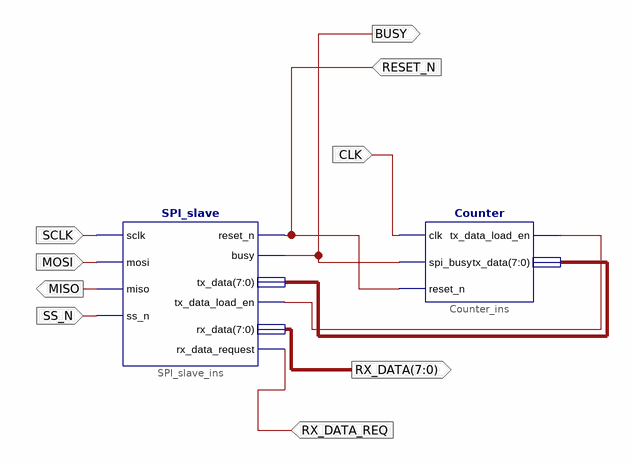
[diagram p0: schematic sheet 1]
// Xilinx ISE schematic Dummy_SPI.sch (spartan6) as structural Verilog: 2 symbols, 9 ports
module Dummy_SPI (
  input  RESET_N,
  input  SCLK,
  input  MOSI,
  input  SS_N,
  input  CLK,
  input  RX_DATA_REQ,
  output MISO,
  output BUSY,
  output [7:0] RX_DATA
);

  wire XLXN_1;
  wire [7:0] XLXN_2;

  SPI_slave SPI_slave_ins (
    .sclk(SCLK), .mosi(MOSI), .ss_n(SS_N), .rx_data_request(RX_DATA_REQ), .tx_data_load_en(XLXN_1),
    .reset_n(RESET_N), .tx_data(XLXN_2), .miso(MISO), .busy(BUSY), .rx_data(RX_DATA));
  Counter Counter_ins (.clk(CLK), .spi_busy(BUSY), .reset_n(RESET_N), .tx_data_load_en(XLXN_1), .tx_data(XLXN_2));
endmodule
